# Altium schematic sheet Sheet1.SchDoc
size B
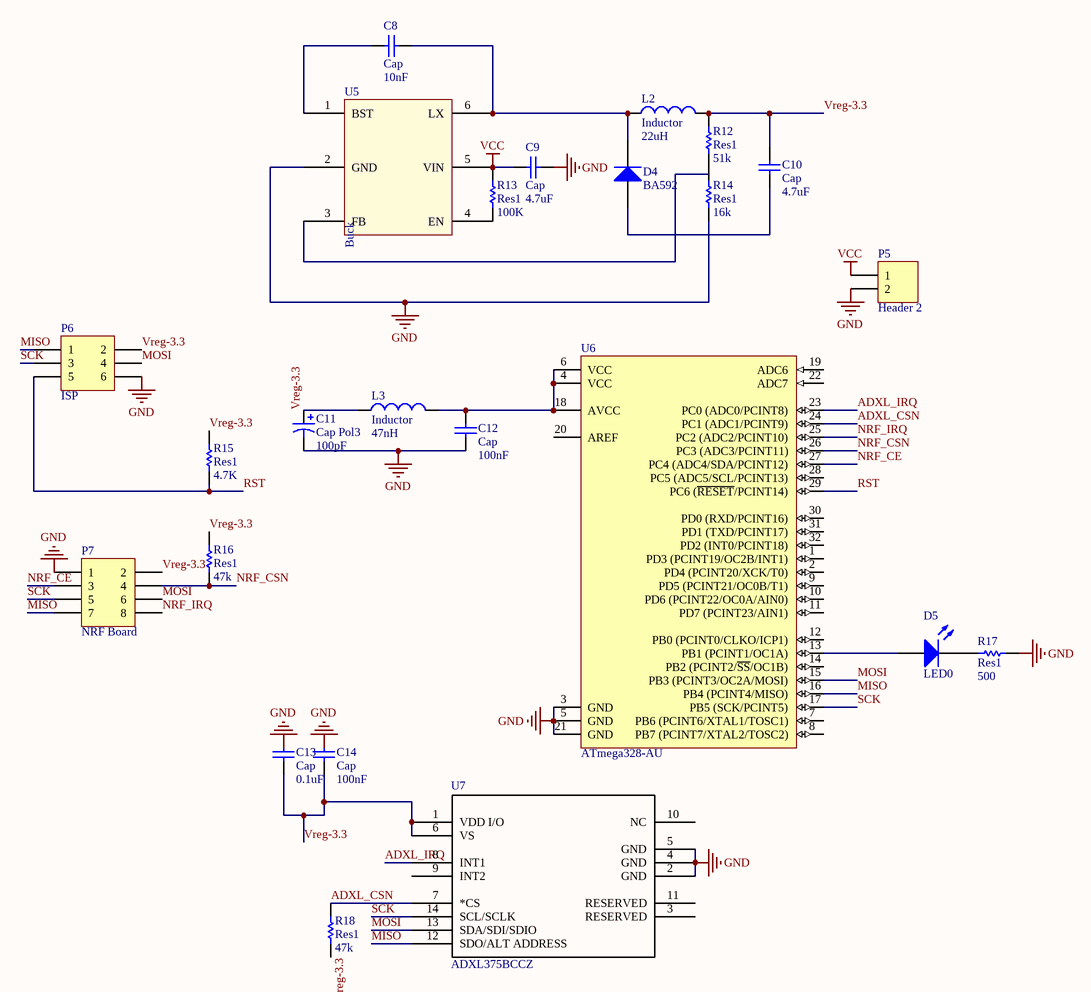
[diagram p0: Sheet1.SchDoc]

## Parts
C8  Cap  value 10nF  [C0805]
C9  Cap  value 4.7uF  [C0805]
C10  Cap  value 4.7uF  [C0805]
C11  Cap Pol3  value 100pF  [C0805]
C12  Cap  value 100nF  [C0805]
C13  Cap  value 0.1uF  [C0805]
C14  Cap  value 100nF  [C0805]
D4  BA592  [SOD-323]
D5  LED0  [3.2X1.6X1.1]
L2  Inductor  value 22uH  [2029]
L3  Inductor  value 47nH  [2029]
P5  Header 2  [HDR1X2]
P6  ISP  [HDR2X3]
P7  NRF Board  [HDR2X4]
R12  Res1  value 51k  [6-0805_N]
R13  Res1  value 100K  [6-0805_N]
R14  Res1  value 16k  [6-0805_N]
R15  Res1  value 4.7K  [6-0805_N]
R16  Res1  value 47k  [6-0805_N]
R17  Res1  value 500  [6-0805_N]
R18  Res1  value 47k  [6-0805_N]
U5  Buck  [SOT23-6]
U6  ATmega328-AU  [32A_N]
U7  ADXL375BCCZ  [LGA_CC-14-1]

## Nets
GND: C9.1 C11.2 C12.1 P5.2 P6.6 P7.1 R14.1 R17.2 U5.2(GND) U6.3(GND) U6.5(GND) U6.21(GND) U7.2(GND) U7.4(GND) U7.5(GND)
VCC: C9.2 P5.1 R13.2 U5.5(VIN)
ADXL_CSN: R18.2 U6.24(PC1_(ADC1/PCINT9)) U7.7(*CS)
ADXL_IRQ: U6.23(PC0_(ADC0/PCINT8)) U7.8(INT1)
MISO: P6.1 P7.7 U6.16(PB4_(PCINT4/MISO)) U7.12(SDO/ALT_ADDRESS)
MOSI: P6.4 P7.6 U6.15(PB3_(PCINT3/OC2A/MOSI)) U7.13(SDA/SDI/SDIO)
NRF_CE: P7.3 U6.27(PC4_(ADC4/SDA/PCINT12))
NRF_CSN: P7.4 R16.1 U6.26(PC3_(ADC3/PCINT11))
NRF_IRQ: P7.8 U6.25(PC2_(ADC2/PCINT10))
RST: P6.5 R15.1 U6.29(PC6_(~{RESET}/PCINT14))
SCK: P6.3 P7.5 U6.17(PB5_(SCK/PCINT5)) U7.14(SCL/SCLK)
Vreg-3.3: C10.2 C11.1 C13.1 C14.1 L2.2 L3.1 P6.2 P7.2 R12.2 R15.2 R16.2 R18.1 U7.1(VDD_I/O) U7.6(VS)
NetC8_1: C8.1 D4.1(K) L2.1 U5.6(LX)
NetC8_2: C8.2 U5.1(BST)
NetC10_1: C10.1 D4.2(A)
NetC12_2: C12.2 L3.2 U6.4(VCC) U6.6(VCC) U6.18(AVCC)
NetD5_1: D5.1(A) U6.13(PB1_(PCINT1/OC1A))
NetD5_2: D5.2(K) R17.1
NetR12_1: R12.1 R14.2
NetR13_1: R13.1 U5.4(EN)

Not connected (* = marked no-connect by the designer): C13 2; C14 2; U5 3(FB); U6 1(PD3_(PCINT19/OC2B/INT1)) 2(PD4_(PCINT20/XCK/T0)) 7(PB6_(PCINT6/XTAL1/TOSC1)) 8(PB7_(PCINT7/XTAL2/TOSC2)) 9(PD5_(PCINT21/OC0B/T1)) 10(PD6_(PCINT22/OC0A/AIN0)) 11(PD7_(PCINT23/AIN1)) 12(PB0_(PCINT0/CLKO/ICP1)) 14(PB2_(PCINT2/~{SS}/OC1B)) 19(ADC6) 20(AREF) 22(ADC7) 28(PC5_(ADC5/SCL/PCINT13)) 30(PD0_(RXD/PCINT16)) 31(PD1_(TXD/PCINT17)) 32(PD2_(INT0/PCINT18)); U7 3(RESERVED) 9(INT2) 10(NC) 11(RESERVED)

## Notes on the sheet
- Labels drawn without touching a wire or pin: GND

## Library data of the parts
C8-C10 C12-C14 = Cap: Capacitor; Published: 8-Jun-2000; LatestRevisionDate: 17-Jul-2002; LatestRevisionNote: Re-released for DXP Platform.; PackageReference: RAD-0.3; Publisher: Altium Limited; PackageDescription: Radial Cap, Thru-Hole; 2 Leads; 0.3 in Pin Spacing
C11 = Cap Pol3: Polarized Capacitor (Surface Mount); Published: 8-Jun-2000; LatestRevisionDate: 29-May-2009; LatestRevisionNote: IPC-7351 Footprint Added.; PackageReference: C0805; Publisher: Altium Limited; PackageDescription: Chip Capacitor
D4 = BA592: Silicon RF Switching Diode for VHF Band Switching in TV/VTR Tuners; Published: 21-Mar-2003; LatestRevisionDate: 19-Mar-2004; LatestRevisionNote: Silkscreen size reduced.; DatasheetDocument: Oct-1999; PackageDocument: Sep-2000; PackageReference: SOD-323; Publisher: Altium Limited; ComponentLink1Description: Manufacturer Link; ComponentLink1URL: http://www.infineon.com/; ComponentLink2Description: Datasheet; ComponentLink2URL: http://www.infineon.com/upload/Document/cmc_upload/documents/080/120/ba592_ba892series_1.pdf
D5 = LED0: Typical INFRARED GaAs LED; Published: 8-Jun-2000; LatestRevisionDate: 08-Jul-2005; LatestRevisionNote: Mech Layer 1 removed.; PackageReference: LED-0; Publisher: Altium Limited; PackageDescription: LED; 2 Leads
L2 L3 = Inductor: Code_IEC: 1005; Published: 8-Jun-2000; LatestRevisionDate: 29-May-2009; LatestRevisionNote: IPC-7351 Footprint Added.; PackageReference: 0402-A; Publisher: Altium Limited; PackageDescription: Chip Inductor; Code_JEITA: 0402
P5 = Header 2: Header, 2-Pin; LatestRevisionDate: 17-Jul-2002; LatestRevisionNote: Re-released for DXP Platform.; Publisher: Altium Limited
P6 = Header 3X2: Header, 3-Pin, Dual row; LatestRevisionDate: 17-Jul-2002; LatestRevisionNote: Re-released for DXP Platform.; Publisher: Altium Limited
P7 = Header 4X2: Header, 4-Pin, Dual row; LatestRevisionDate: 17-Jul-2002; LatestRevisionNote: Re-released for DXP Platform.; Publisher: Altium Limited
R12-R18 = Res1: Resistor; Published: 8-Jun-2000; LatestRevisionDate: 17-Jul-2002; LatestRevisionNote: Re-released for DXP Platform.; PackageReference: AXIAL-0.3; Publisher: Altium Limited; PackageDescription: Axial Device, Thru-Hole; 2 Leads; 0.3 in Pin Spacing
U5 = Component_1
U6 = ATmega328-AU: 8-bit AVR Microcontroller, 32KB Flash, 1KB EEPROM, 2KB SRAM, 32-pin TQFP, Industrial Grade (-40°C to 85°C); Published: 1-Apr-2010; DatasheetVersion: revA, Jan-2010; PackageVersion: revB, Oct-2001; PackageReference: 32A; Publisher: Altium Limited; PackageDescription: 32-Lead, 7x7x1.0 mm Body, 0.8mm Lead Pitch, Thin Profile Plastic Quad Flat Package (TQFP); Supplier 1: Digi-Key; Supplier Part Number 1: ATMEGA328-AU-ND; Supplier 2: Mouser; Supplier Part Number 2: 556-ATMEGA328-AU; Code_JEDEC: MS-026-ABA; ComponentLink1Description: Manufacturer Link; ComponentLink1URL: http://www.atmel.com/products/avr/default.asp?; ComponentLink2Description: ATmega48A/48PA/88A/88PA/168A/168PA/328/328P Datasheet; ComponentLink2URL: http://www.atmel.com/dyn/resources/prod_documents/8271.pdf; ComponentLink3Description: ATmega48A/48PA/88A/88PA/168A/168PA/328/328P Summary; ComponentLink3URL: http://www.atmel.com/dyn/resources/prod_documents/8271S.pdf; ComponentLink4Description: Atmel.com Home; ComponentLink4URL: http://www.atmel.com
U7 = ADXL345BCCZ: Imported; RefDes: RefDes; Type: DEV; Value: Value